# EAGLE design rs-485-power-injector-leanpcb (EAGLE 7.5.0)
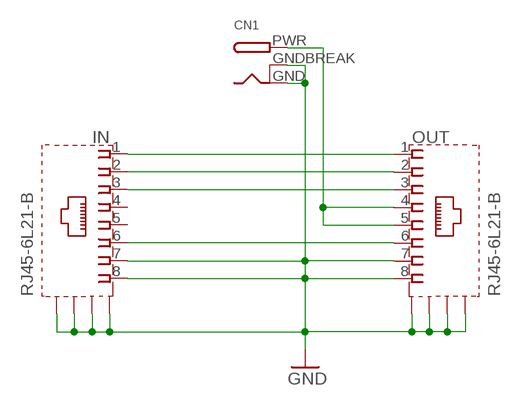
[diagram p0: schematic, sheet 1]

## Parts
CN1  DCBARRELPTH  [DCJACK_2MM_PTH]
IN  RJ45-6L21-B  [RJ45-SHIELD1]
OUT  RJ45-6L21-B  [RJ45-SHIELD1]

## Nets
GND: CN1.GND CN1.GNDBREAK IN.7 IN.8 IN.S1(S) IN.S2(S) IN.S3(S) IN.S4(S) OUT.7 OUT.8 OUT.S1(S) OUT.S2(S) OUT.S3(S) OUT.S4(S)
N$1: IN.1 OUT.1
N$2: IN.2 OUT.2
N$3: IN.3 OUT.3
N$4: IN.6 OUT.6
N$6: CN1.PWR OUT.4 OUT.5
Unconnected: IN.4 IN.5

## Library data of the parts
CN1 = adafruit:DCBARREL: 2.0mm DC Barrel Jack DCJACK_2MM_PTH - Through Hole Jack (4UConnector: 05537)
IN OUT = con-tycoelectronics:RJ45*2: RJ45 Low Profile Shield Type 2 For all RJ45 L, LC, LCT and X Series Models Source: www.tycoelectronics.com .. ENG_DS_1654001_1099_RJ_L_0507.pdf; OC_FARNELL: unknown; OC_NEWARK: unknown

## Board
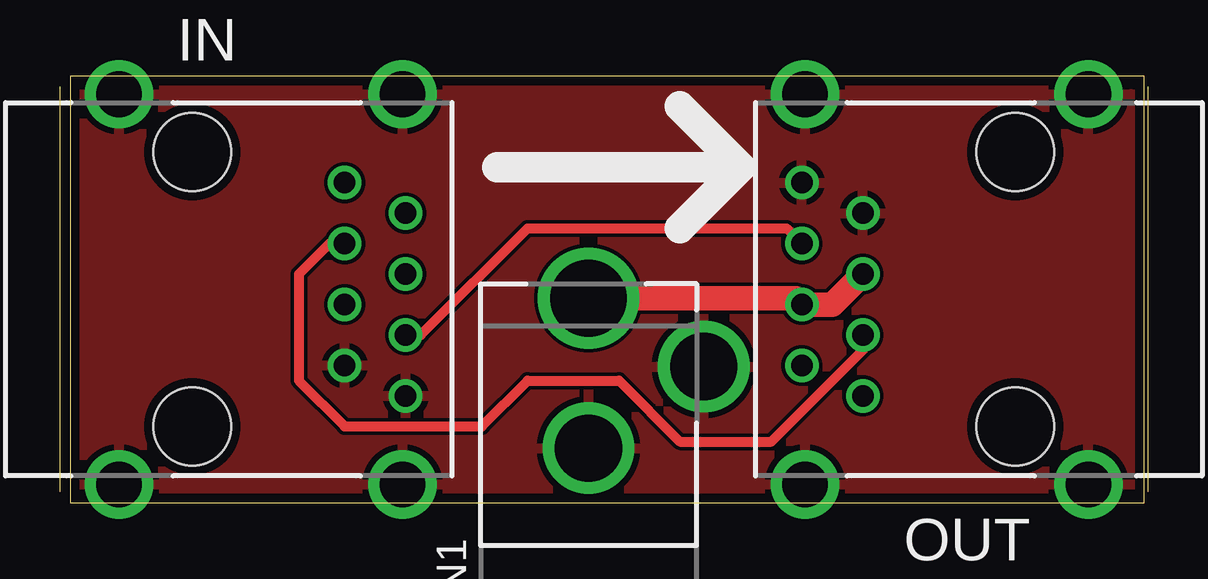
[diagram p1: board, top side]
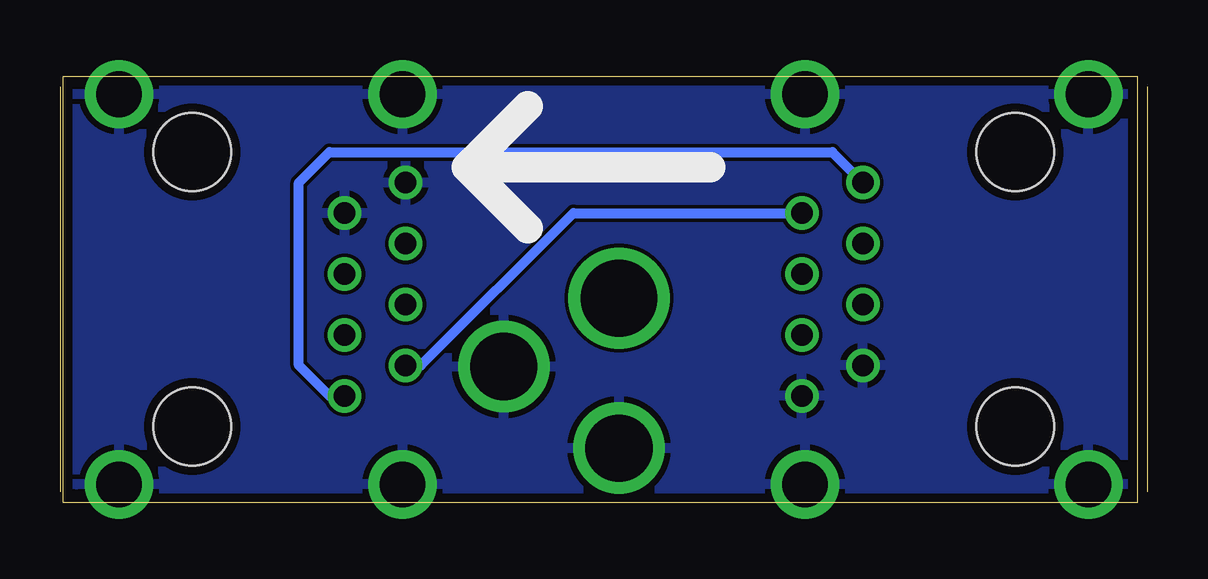
[diagram p2: board, bottom side, seen from below]

Size 44.76 x 17.77 mm. Coordinates in mm from the lower left corner, seen from the top.
Outline: 0,0 44.76,0 44.76,17.77 0,17.77 0,0
Copper layers (1*16): Top 0.0356mm / dielectric 1.5011mm / Bottom 0.0356mm
Design rules "LaenPCBOrder": minimum track width 6mil, minimum drill 13mil, track to track 6mil, track to pad 6mil, pad to pad 6mil, via to via 6mil, smd to smd 6mil, copper to edge 15mil, drill to drill 6mil, minimum pad ring 7mil, minimum via ring 7mil, stop-mask expansion 4mil, vias tented up to drill 0mil, thermal gap 10mil

### Footprints (pad centres in the part's own frame; a part is rotated, then mirrored left to right if it is on the bottom)
DCJACK_2MM_PTH = drill 2.8: GND 0,7.35; GNDBREAK 4.8,10.75 | drill 3.2: PWR 0,13.6
RJ45-SHIELD1 = drill 0.9 pad 1.4: 1 -4.445,6.35; 2 -3.175,8.89; 3 -1.905,6.35; 4 -0.635,8.89; 5 0.635,6.35; 6 1.905,8.89; 7 3.175,6.35; 8 4.445,8.89 | drill 1.9 pad 2.5: S1 -8.128,-3.048; S2 8.128,-3.048; S3 -8.128,8.76; S4 8.128,8.76 | hole 3.251: -5.715,0; 5.715,0

### Placement (x,y rotation side)
CN1  21.59,-5.08 0 top
IN  5.08,8.89 270 top
OUT  39.37,8.89 90 top

### Tracks (layer width: path | path; a pad name or v marks a point on that pad's centre or on a via)
GND
  pour Bottom: 0,17.78 44.45,17.78 44.45,0 0,0
  pour Top: 0,17.78 44.45,17.78 44.45,0 0,0
N$1
  Bottom 0.406: OUT.1 33.66,4.45 34.92,5.71 34.92,13.34 33.66,14.61 12.7,14.61 IN.1
N$2
  Bottom 0.406: OUT.2 29.84,5.71 23.5,12.06 IN.2
N$3
  Top 0.406: IN.3 10.79,10.79 9.53,9.53 9.53,5.08 11.43,3.17 17.14,3.17 19.05,5.08 22.86,5.08 25.4,2.54 29.21,2.54 33.02,6.35 OUT.3
N$4
  Top 0.406: IN.6 14.61,6.99 19.05,11.43 29.84,11.43 OUT.6
N$6
  Top 1.016: CN1.PWR 30.21,8.52 OUT.4 31.75,8.26 OUT.5